# EAGLE design DUAL POWER SUPPLY (EAGLE 9.6.2)
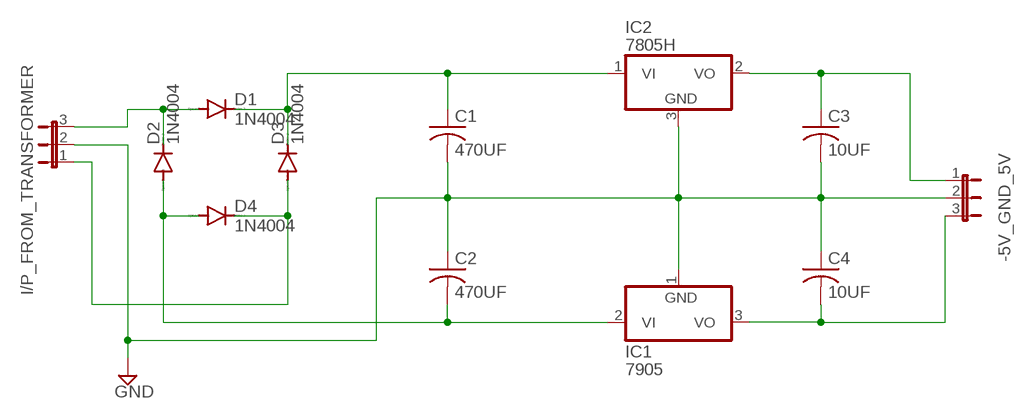
[diagram p0: schematic, sheet 1]

## Parts
-5V_GND_5V  JP2W  [JP2W]
C1  470UF  C-US025-024X044  [C025-024X044]
C2  470UF  C-US025-024X044  [C025-024X044]
C3  10UF  C-US025-024X044  [C025-024X044]
C4  10UF  C-US025-024X044  [C025-024X044]
D1  1N4004  [DO41-10]
D2  1N4004  [DO41-10]
D3  1N4004  [DO41-10]
D4  1N4004  [DO41-10]
I/P_FROM_TRANSFORMER  JP2W  [JP2W]
IC1  7905  7905H  [TO39]
IC2  7805H  [TO39]

## Nets
GND: -5V_GND_5V.2 C1.2 C2.1 C3.2 C4.1 I/P_FROM_TRANSFORMER.2 IC1.1(GND) IC2.3(GND)
N$1: D1.A D2.C I/P_FROM_TRANSFORMER.3
N$2: C2.2 D2.A D4.A IC1.2(VI)
N$3: D3.A D4.C I/P_FROM_TRANSFORMER.1
N$5: C1.1 D1.C D3.C IC2.1(VI)
N$8: -5V_GND_5V.1 C3.1 IC2.2(VO)
N$10: -5V_GND_5V.3 C4.2 IC1.3(VO)

## Library data of the parts
-5V_GND_5V I/P_FROM_TRANSFORMER = jumper:JP2W: JUMPER
C1-C4 = rcl:C-US: CAPACITOR, American symbol; SPICEPREFIX: C
D1-D4 = diode:1N4004: DIODE general purpose rectifier, 1 A
IC1 = linear:79*: Negative VOLTAGE REGULATOR
IC2 = linear:78*: Positive VOLTAGE REGULATOR Source: http://cache.national.com/ds/LM/LM78L05.pdf http://www.fairchildsemi.com/ds/LM/LM7805.pdf

## Board
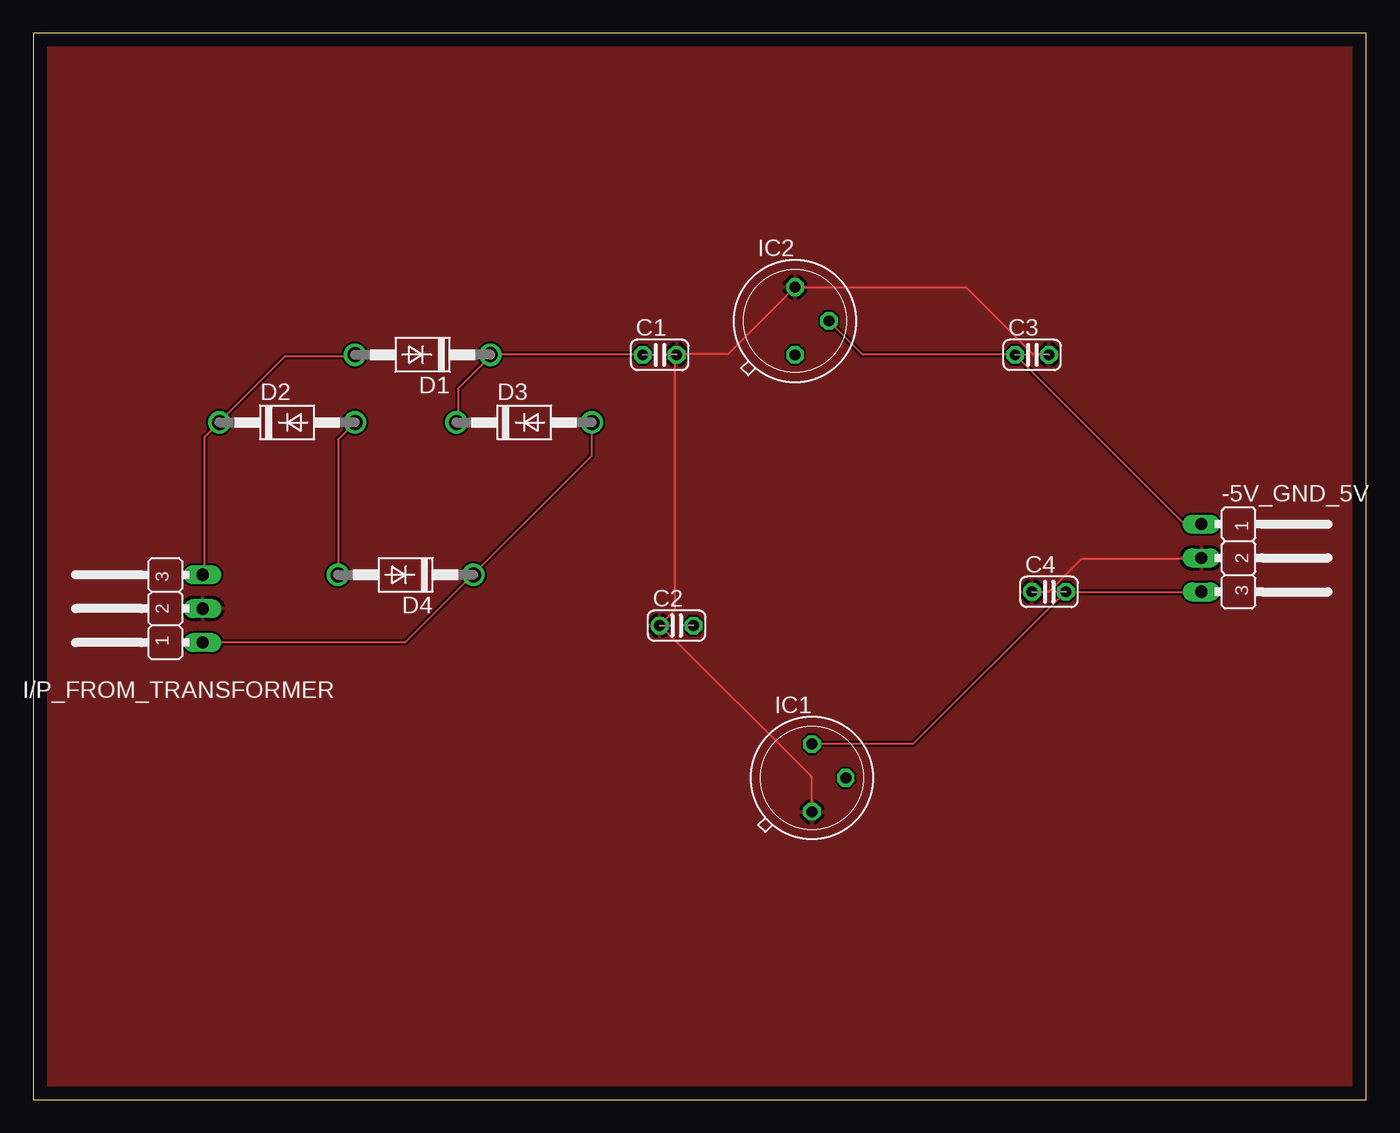
[diagram p1: board, top side]
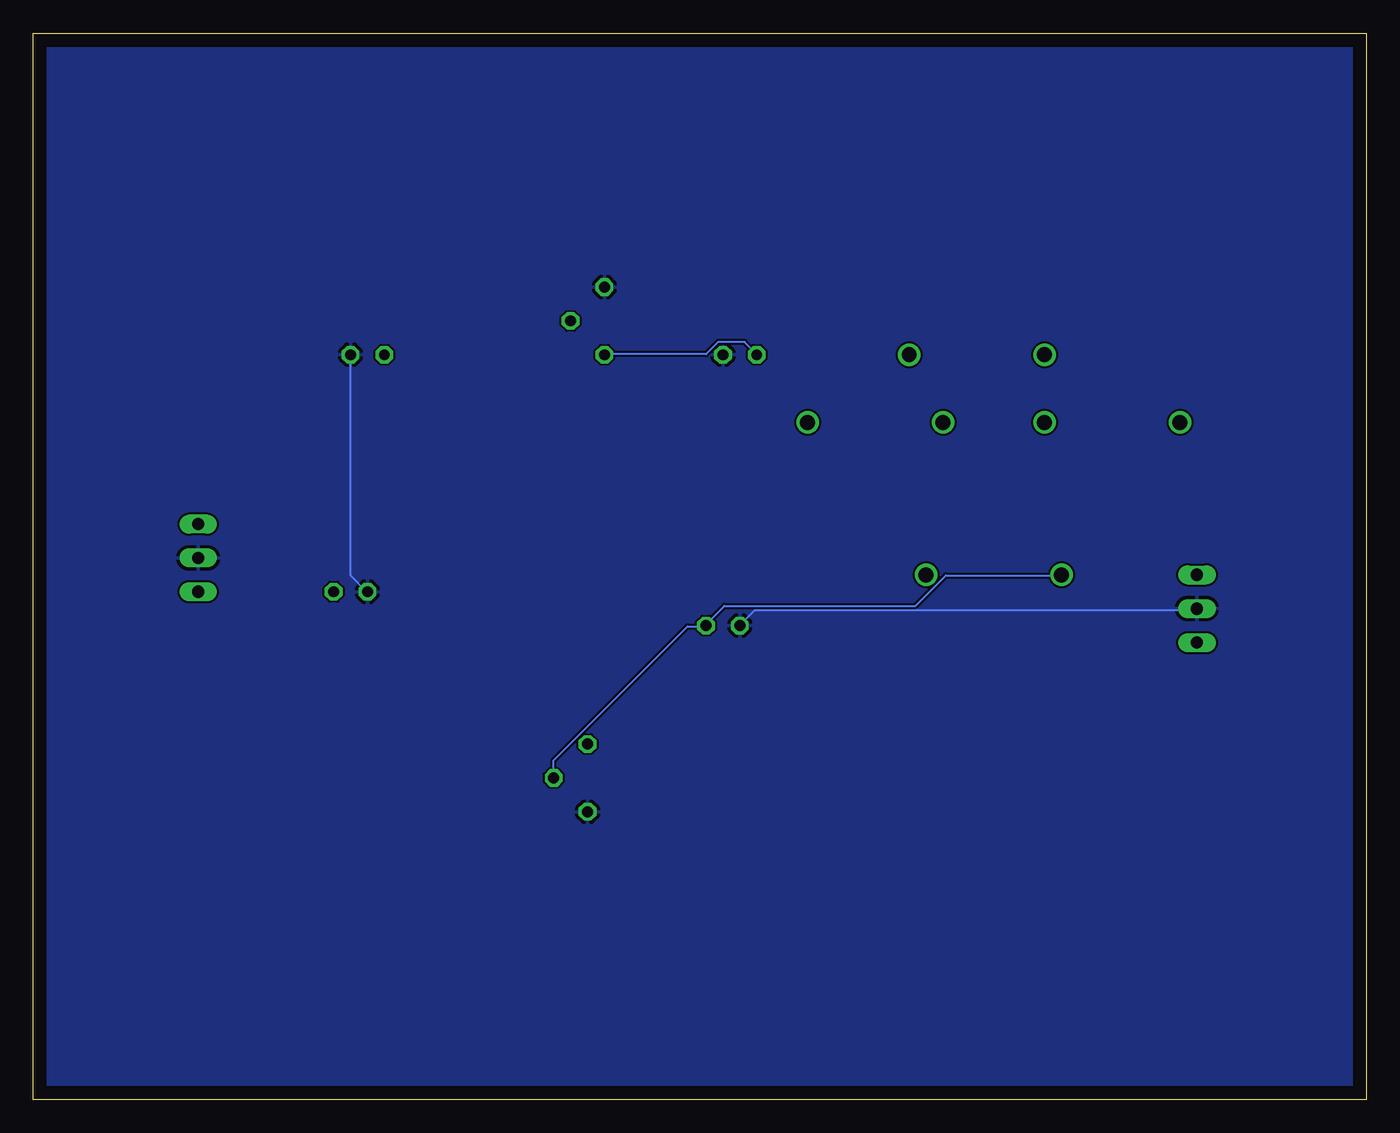
[diagram p2: board, bottom side, seen from below]

Size 100 x 80 mm. Coordinates in mm from the lower left corner, seen from the top.
Outline: 0,0 100,0 100,80 0,80 0,0
Copper layers (1*16): Top 0.035mm / dielectric 1.5mm / Bottom 0.035mm
Design rules "default": minimum track width 6mil, minimum drill 0.35mm, track to track 6mil, track to pad 6mil, pad to pad 6mil, via to via 6mil, smd to smd 6mil, copper to edge 40mil, drill to drill 6mil, minimum pad ring 10mil, minimum via ring 8mil, stop-mask expansion 4mil, vias tented up to drill 0mil, thermal gap 10mil

### Footprints (pad centres in the part's own frame; a part is rotated, then mirrored left to right if it is on the bottom)
JP2W = drill 0.914 long: 1 -2.54,-1.27; 2 0,-1.27; 3 2.54,-1.27
C025-024X044 = drill 0.813 octagon: 1 -1.27,0; 2 1.27,0
DO41-10 = drill 1.118: A 5.08,0; C -5.08,0
TO39 = drill 0.813 octagon: 1 0,-2.54; 2 2.54,0; 3 0,2.54

### Placement (x,y rotation side)
-5V_GND_5V  88.9,40.64 270 top
C1  46.99,55.88 0 top
C2  48.26,35.56 0 top
C3  74.93,55.88 0 top
C4  76.2,38.1 0 top
D1  29.21,55.88 180 top
D2  19.05,50.8 0 top
D3  36.83,50.8 0 top
D4  27.94,39.37 180 top
I/P_FROM_TRANSFORMER  11.43,36.83 90 top
IC1  58.42,24.13 0 top
IC2  57.15,58.42 0 top

### Tracks (layer width: path | path; a pad name or v marks a point on that pad's centre or on a via)
GND
  Top 0.152: C4.1 76.2,38.1 78.64,40.54 87.63,40.54 -5V_GND_5V.2 | IC1.1 58.37,21.64 58.37,24.23 47.09,35.51 C2.1 48.16,36.73 48.16,55.78 C1.2 48.31,55.93 52.12,55.93 IC2.3 69.95,60.96 74.98,55.93 76.2,55.93 C3.2
  Bottom 0.152: C3.2 76.2,39.32 74.98,38.1 C4.1 | I/P_FROM_TRANSFORMER.2 12.8,36.73 45.87,36.73 46.94,35.66 C2.1
  pour Top: -5.08,83.82 107.95,83.82 107.95,-2.54 104.14,-6.35 -3.81,-6.35 -6.35,-3.81 -6.35,82.55
  pour Bottom: -8.89,81.28 110.49,81.28 111.76,80.01 113.03,78.74 113.03,-7.62 -3.81,-7.62 -11.43,0 -11.43,78.74
N$1
  Top 0.152: I/P_FROM_TRANSFORMER.3 12.8,39.47 12.8,49.68 13.87,50.75 D2.C 14.02,50.9 18.9,55.78 24.08,55.78 D1.A
N$2
  Top 0.152: D4.A 22.86,49.53 D2.A
  Bottom 0.152: IC1.2 60.96,25.45 50.9,35.51 49.53,35.51 C2.2 49.53,35.66 48.16,37.03 33.83,37.03 31.55,39.32 22.86,39.32 D4.A
N$3
  Top 0.152: I/P_FROM_TRANSFORMER.1 27.89,34.29 32.92,39.32 D4.C 33.07,39.47 41.91,48.31 D3.A
N$5
  Top 0.152: C1.1 45.72,55.93 34.29,55.93 D1.C 34.29,55.78 31.85,53.34 31.85,50.9 D3.C
  Bottom 0.152: IC2.1 57.15,55.93 49.53,55.93 48.62,56.84 46.63,56.84 45.72,55.93 C1.1
N$8
  Top 0.152: IC2.2 62.18,55.93 73.61,55.93 C3.1 86.26,43.28 87.63,43.28 -5V_GND_5V.1
N$10
  Top 0.152: IC1.3 65.99,26.67 77.42,38.1 C4.2 -5V_GND_5V.3